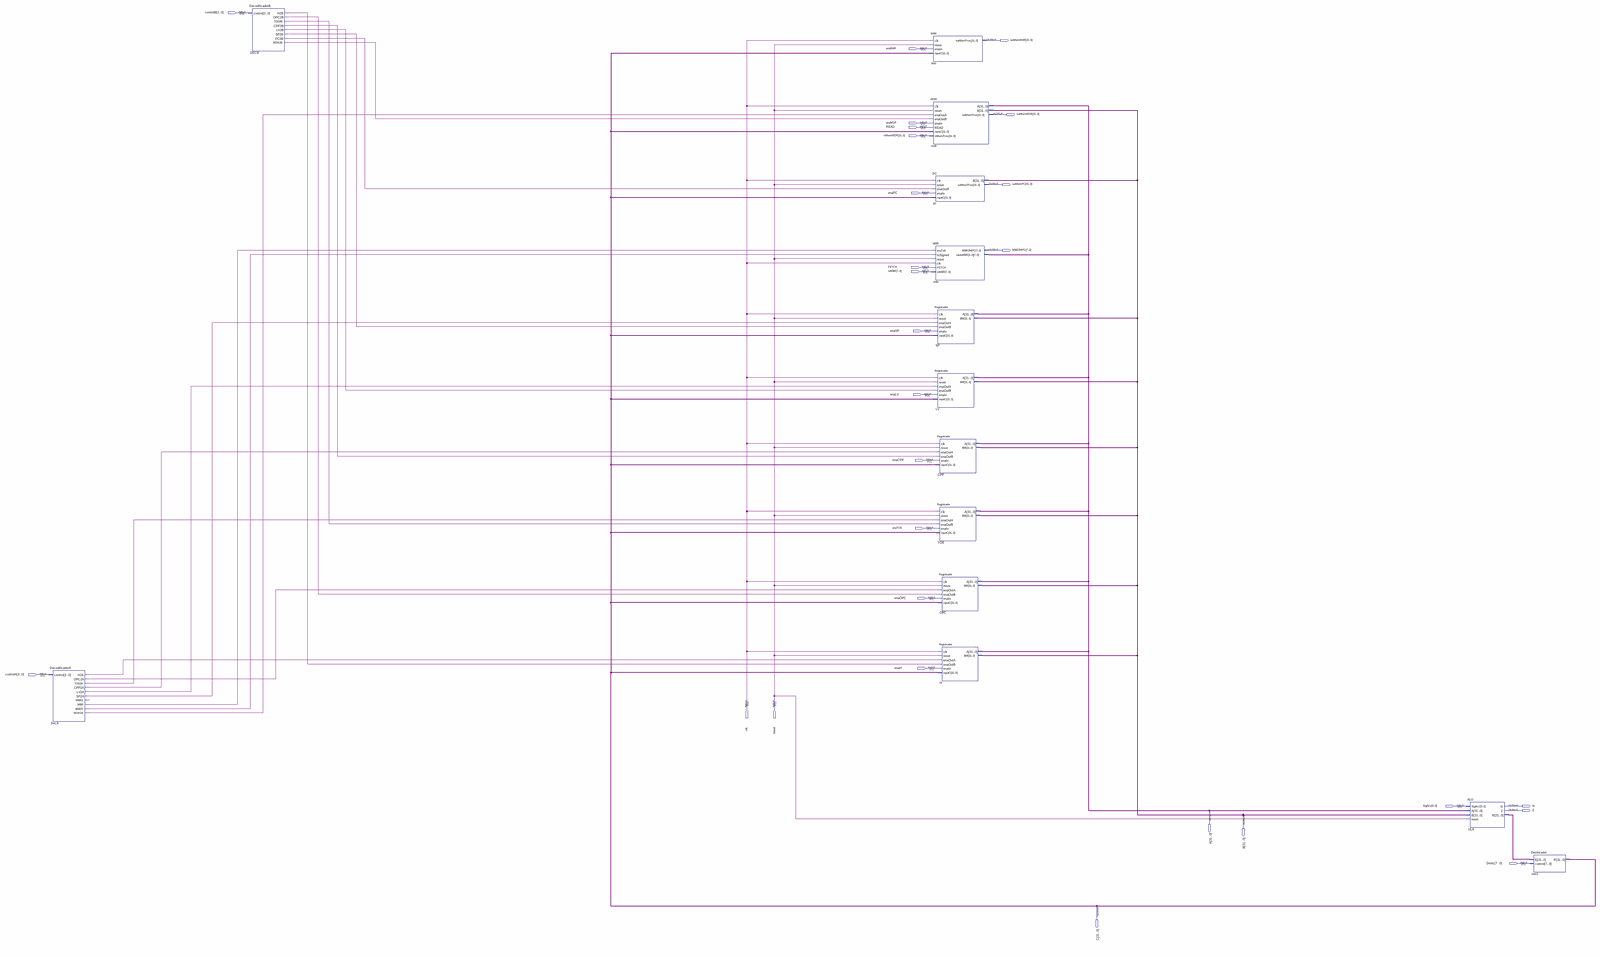
[diagram p0: schematic sheet, whole]
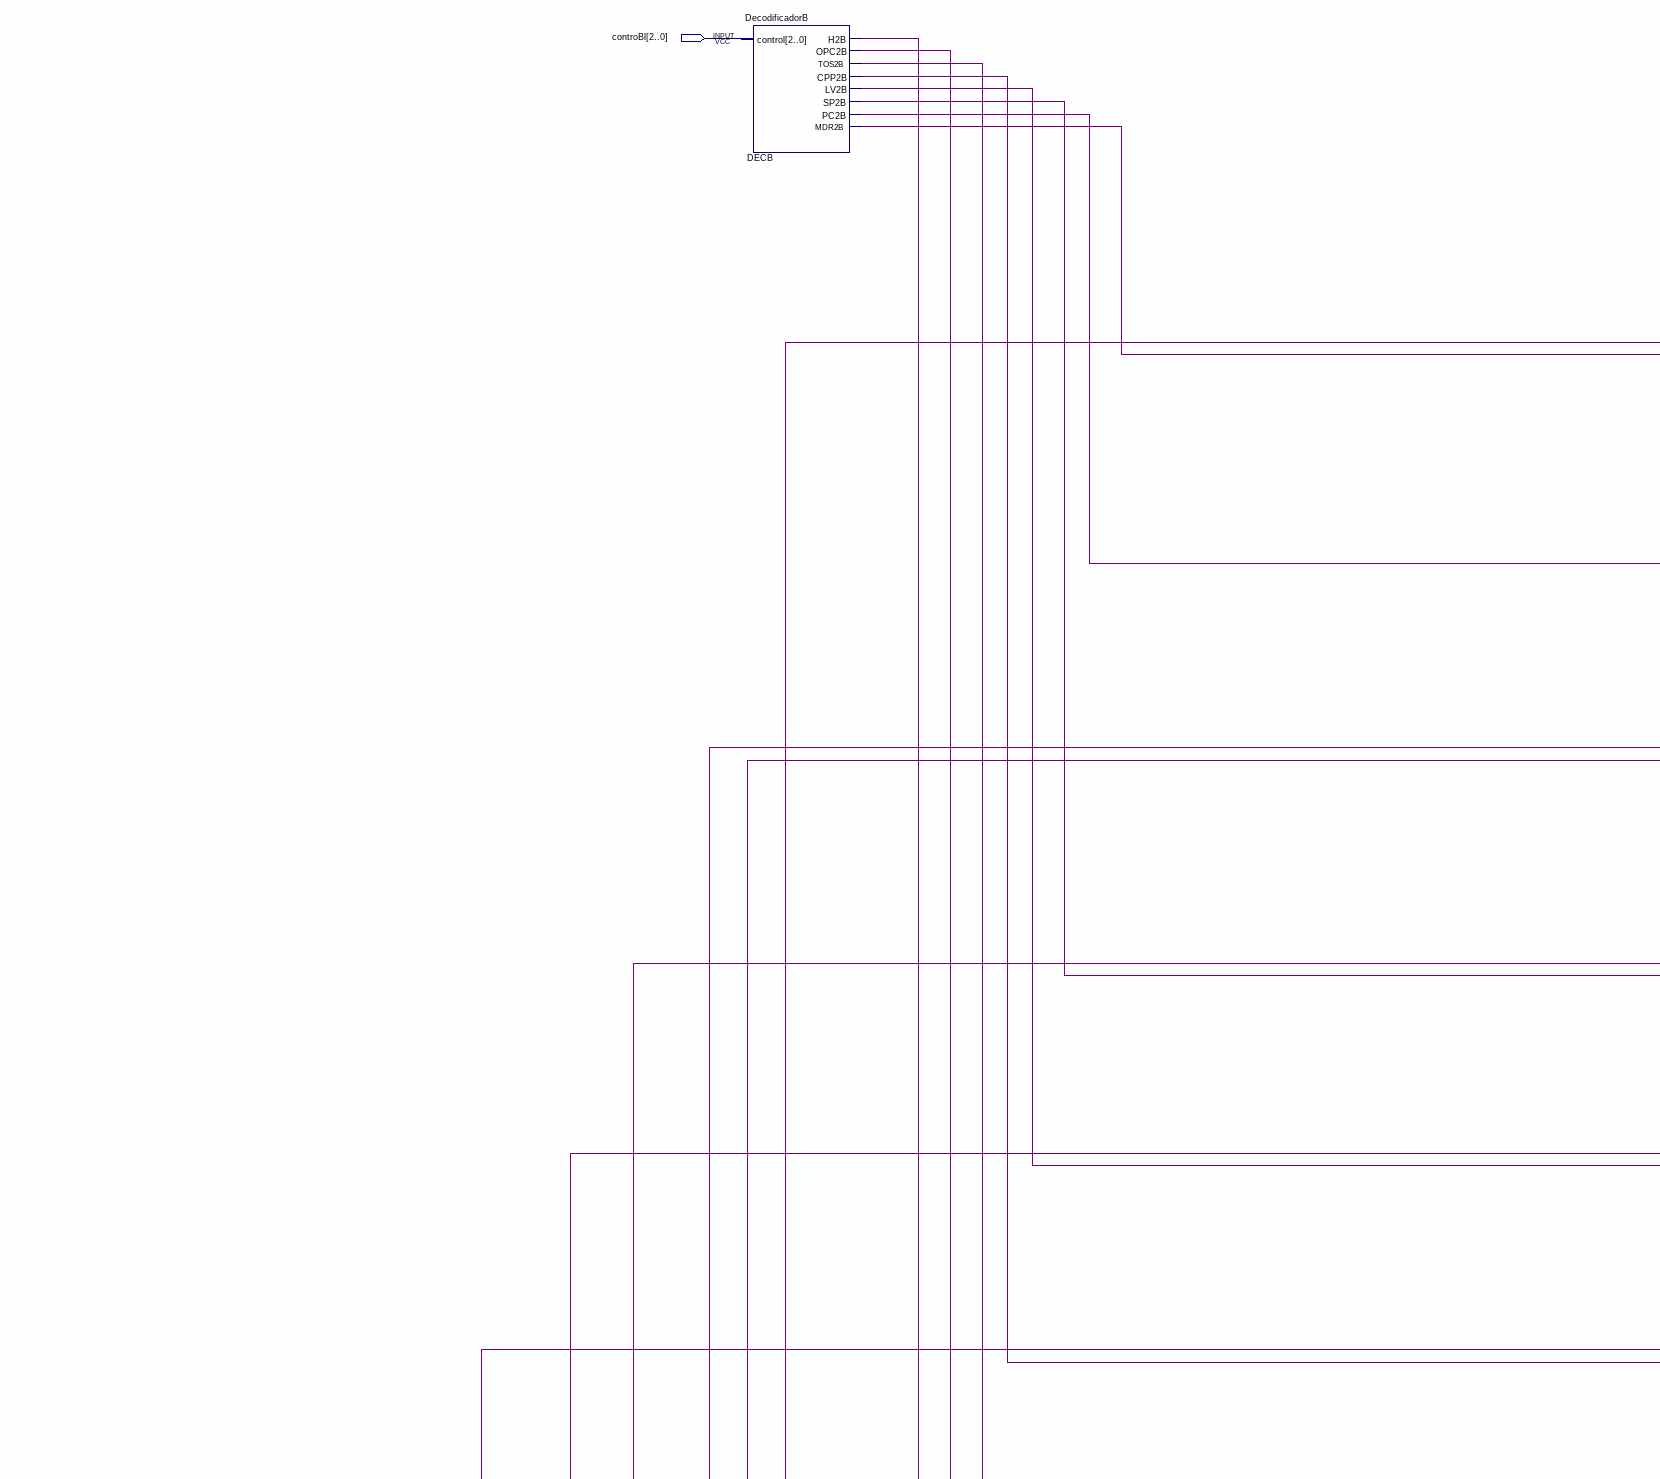
[diagram p1: schematic sheet, upper left part]
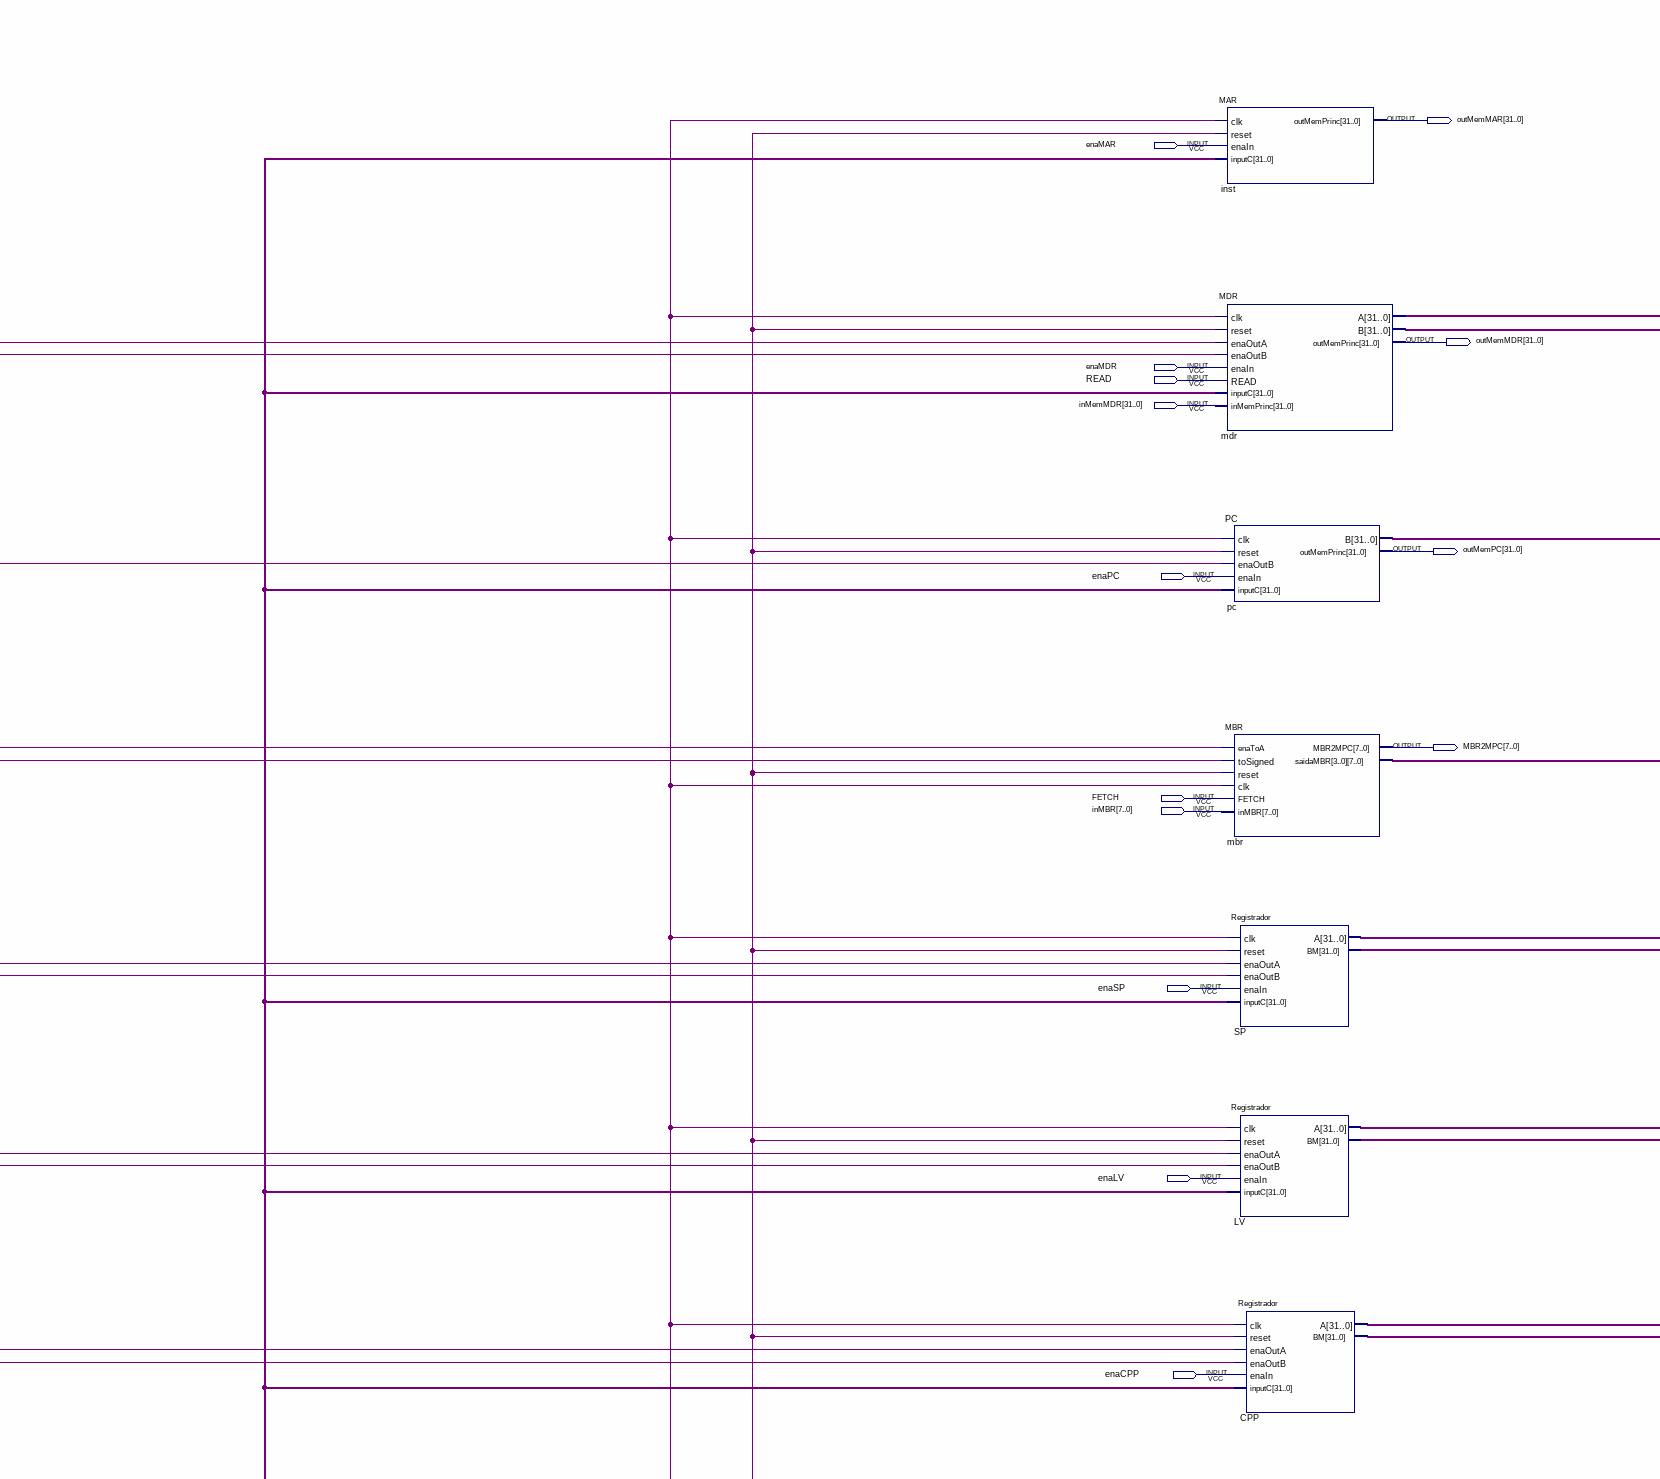
[diagram p2: schematic sheet, upper centre part]
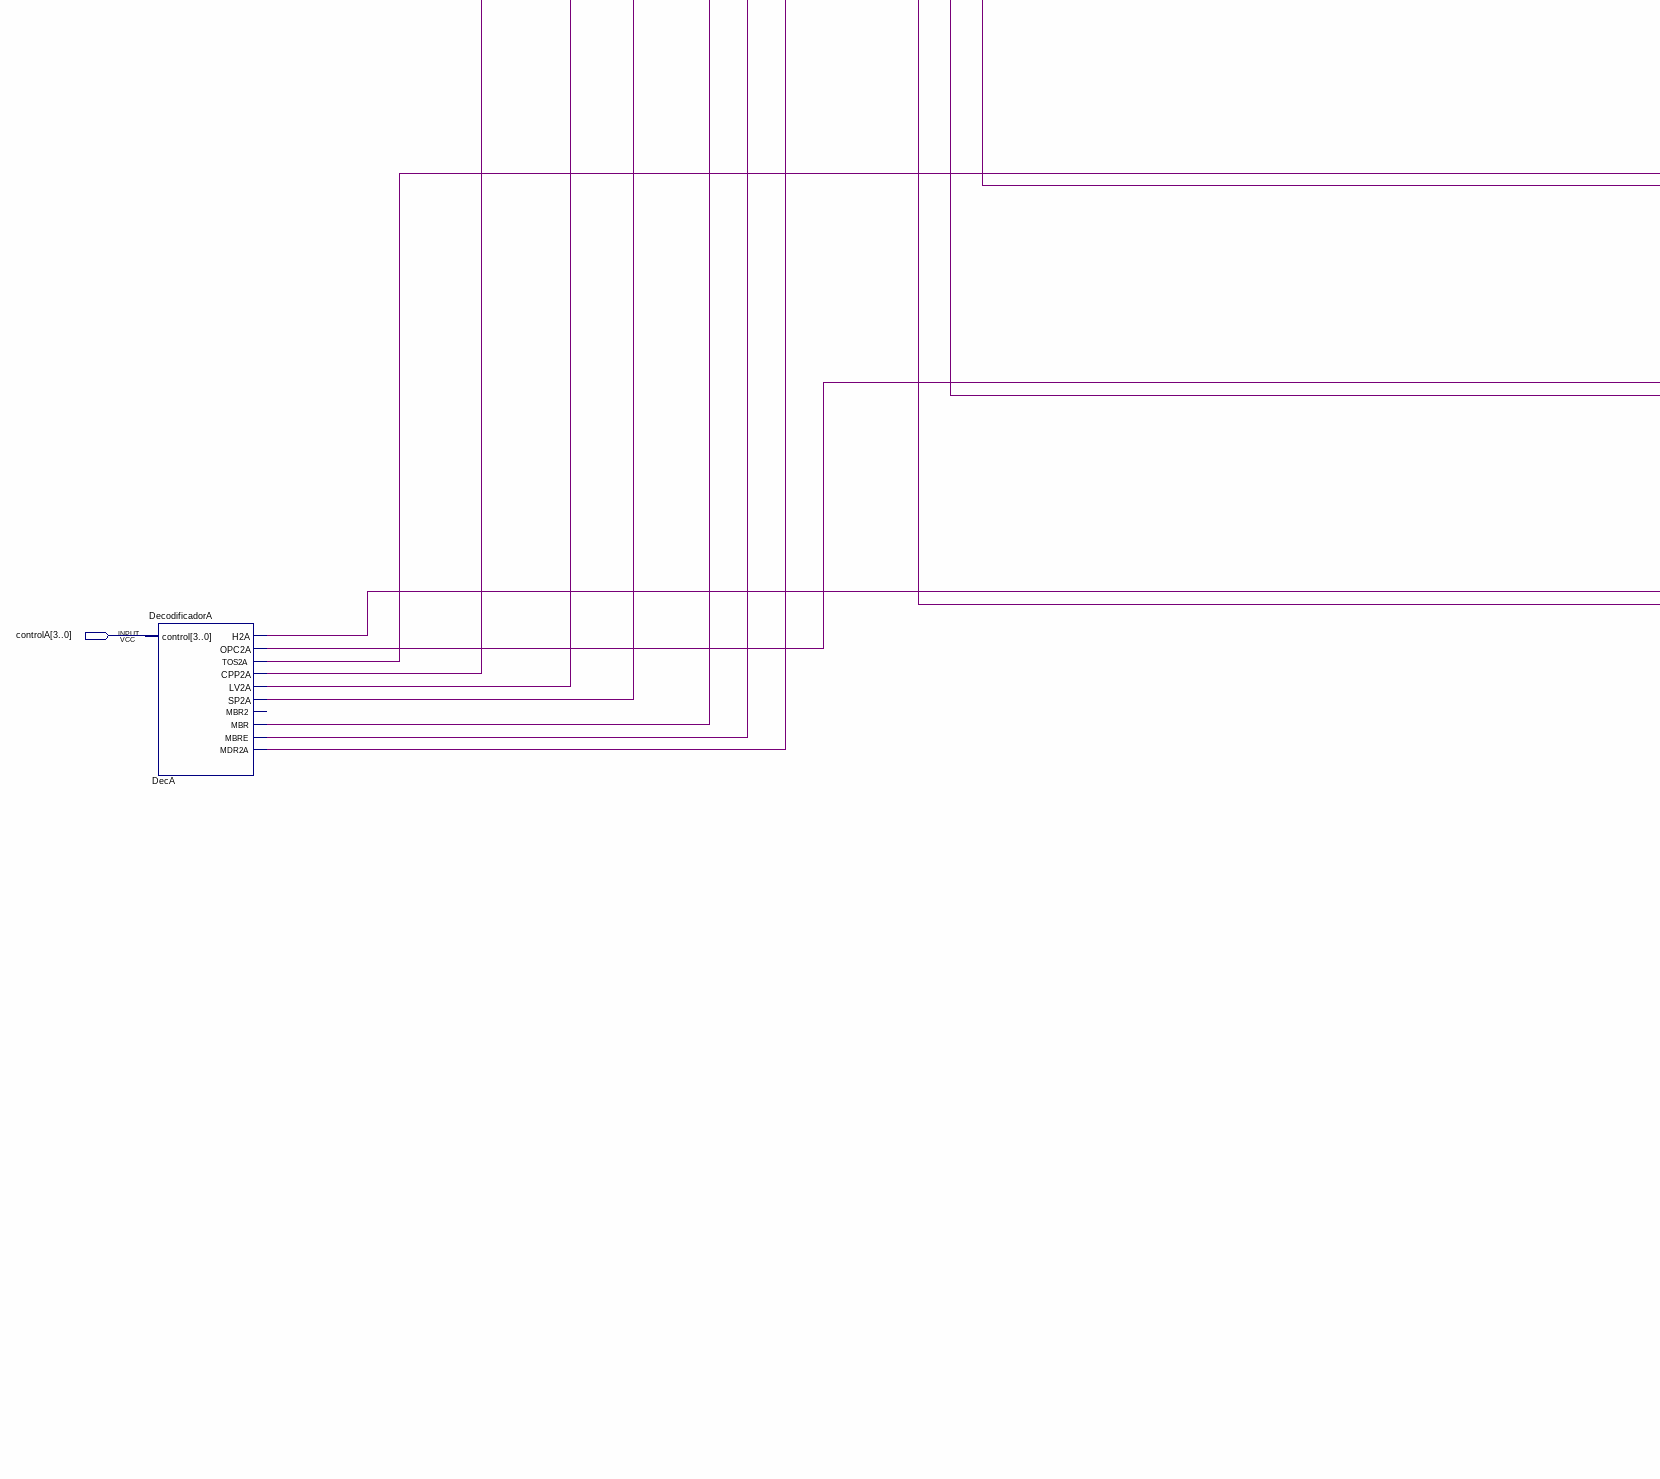
[diagram p3: schematic sheet, lower left part]
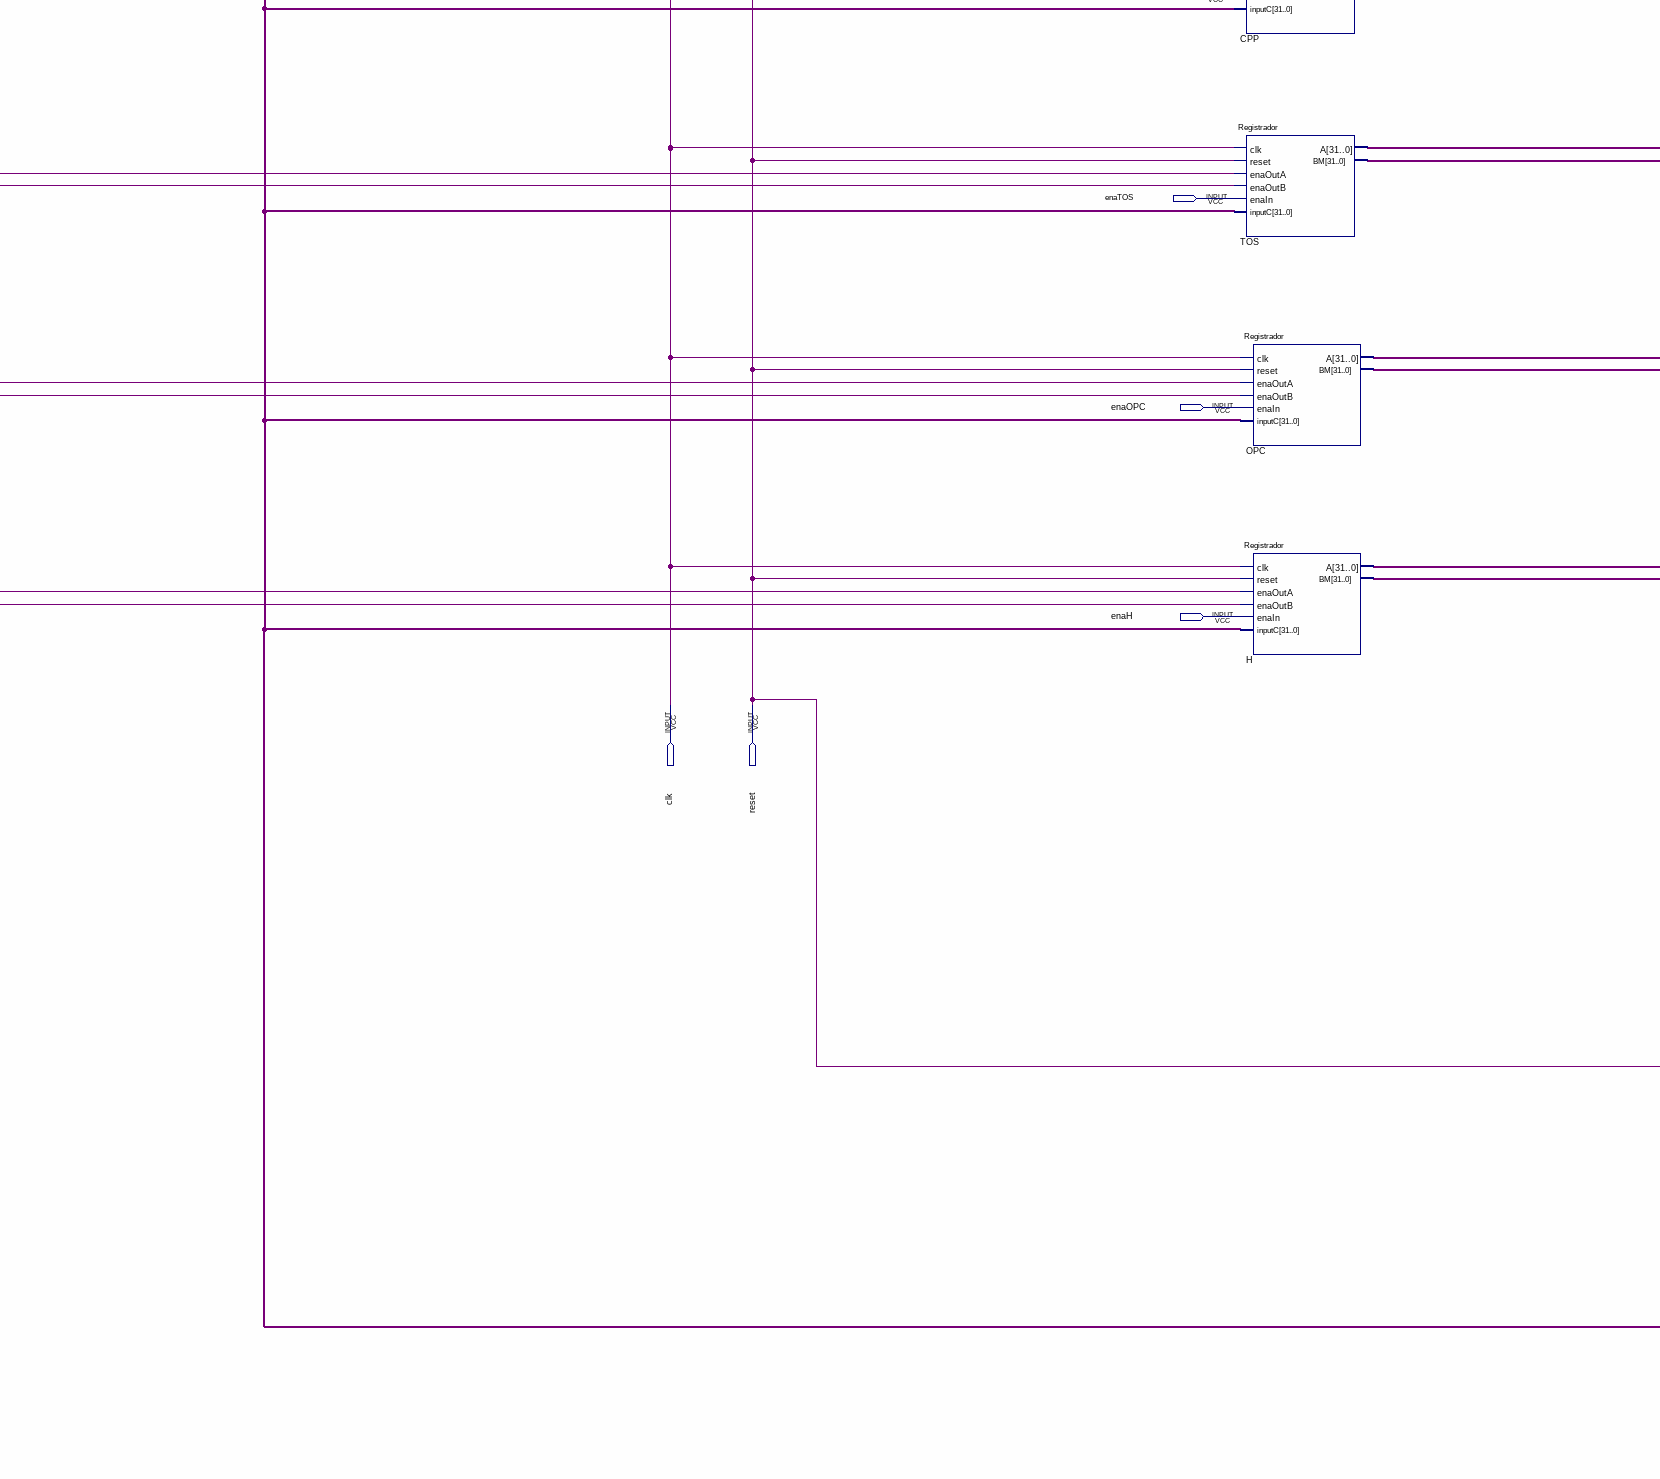
[diagram p4: schematic sheet, lower centre part]
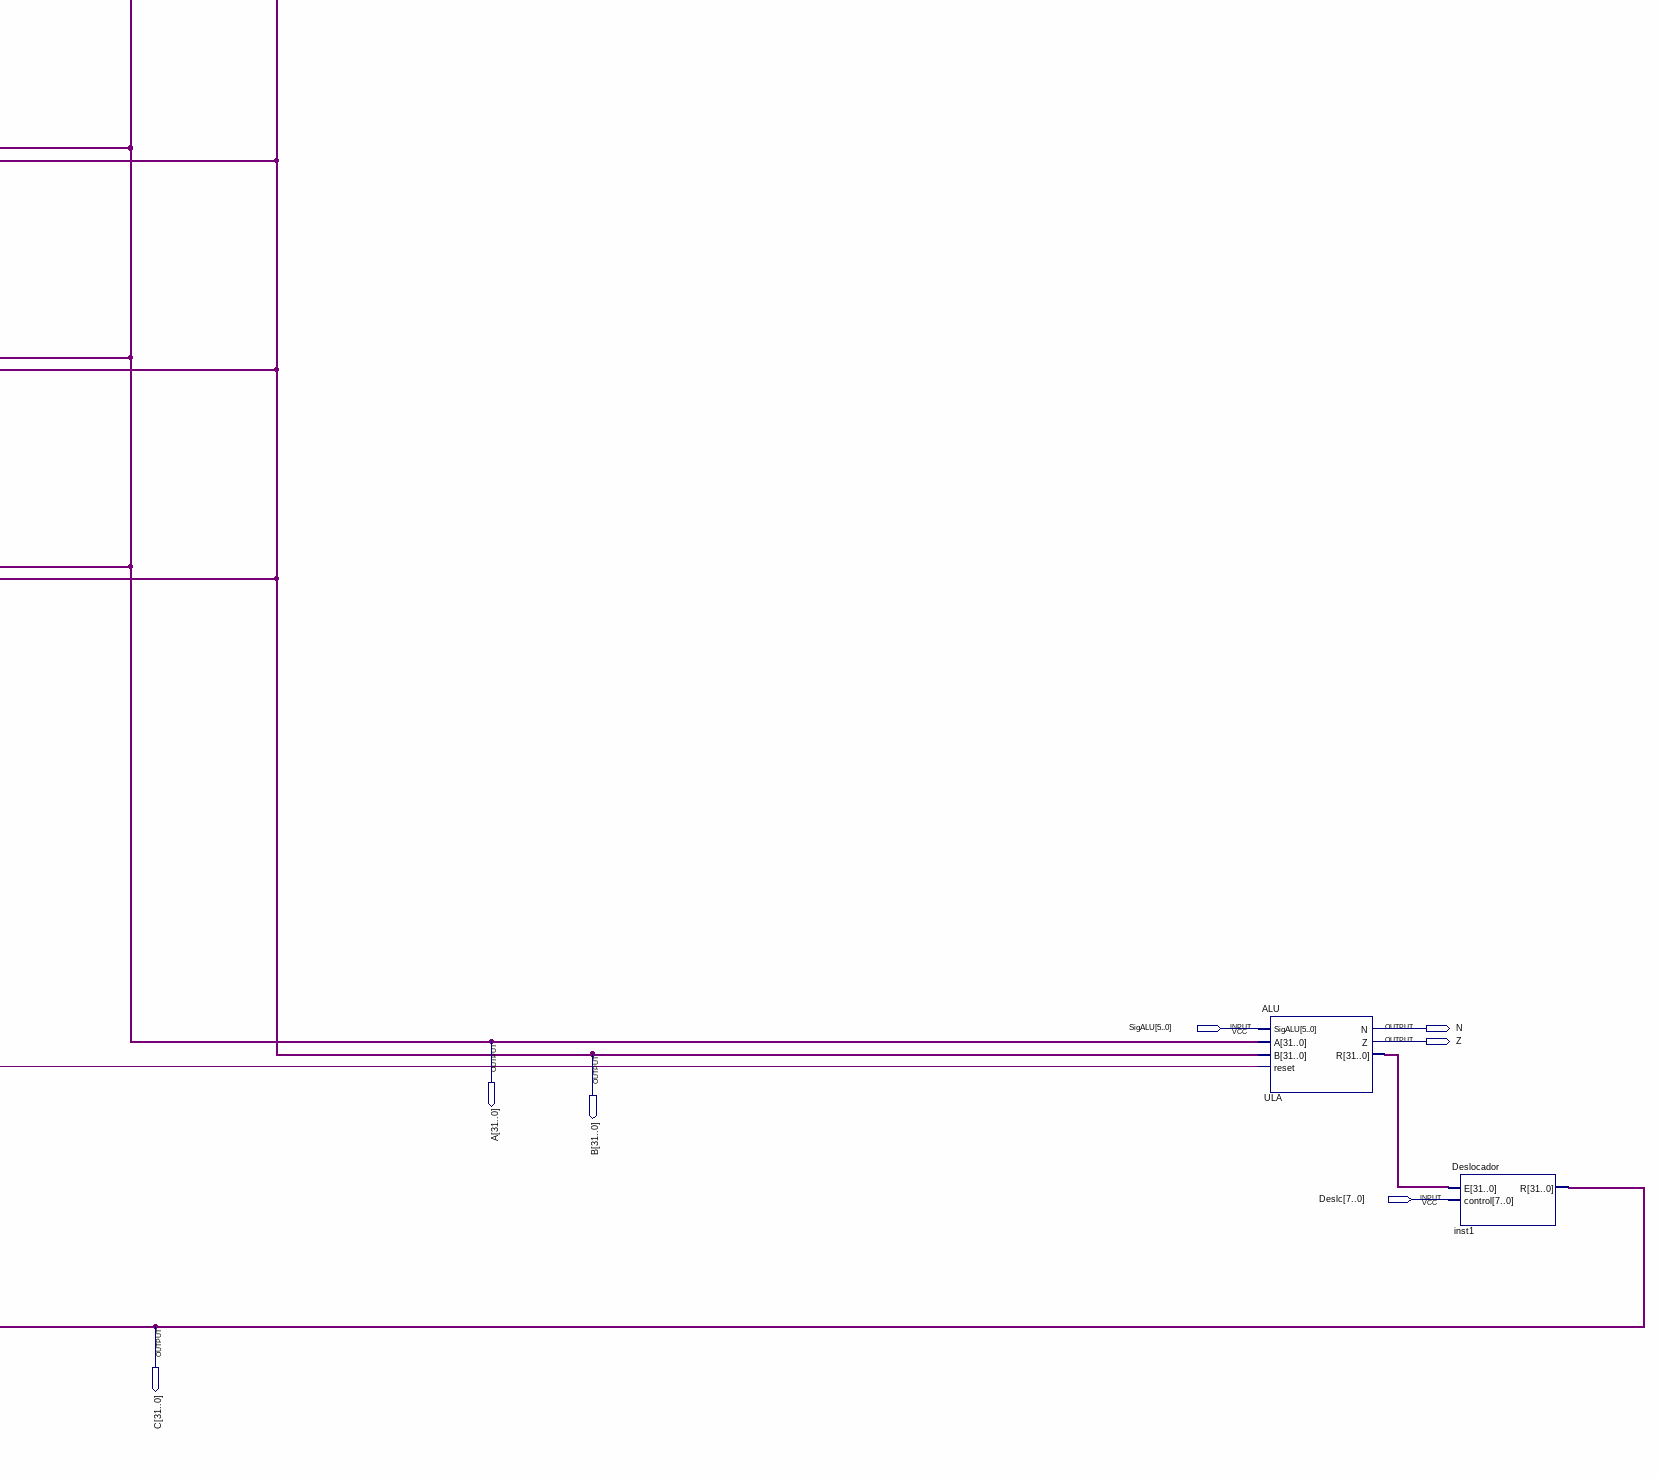
[diagram p5: schematic sheet, lower right part]
// Quartus schematic DATA_PATH.bdf as structural Verilog: 14 symbols, 28 pins
module DATA_PATH (
  input  [2:0] controBl,
  input  enaMAR,
  input  enaMDR,
  input  READ,
  input  [31:0] inMemMDR,
  input  enaPC,
  input  FETCH,
  input  [7:0] inMBR,
  input  enaSP,
  input  enaLV,
  input  enaCPP,
  input  enaTOS,
  input  enaOPC,
  input  enaH,
  input  [3:0] controlA,
  input  clk,
  input  reset,
  input  [5:0] SigALU,
  input  [7:0] Deslc,
  output [31:0] outMemMAR,
  output [31:0] outMemMDR,
  output [31:0] outMemPC,
  output [7:0] MBR2MPC,
  output N,
  output [31:0] A,
  output Z,
  output [31:0] B,
  output [31:0] C
);

  wire DecA_cpp2a, DecA_h2a, DecA_lv2a, DecA_mbr, DecA_mbre, DecA_mdr2a, DecA_opc2a, DecA_sp2a, DecA_tos2a,
       DECB_cpp2b, DECB_h2b, DECB_lv2b, DECB_mdr2b, DECB_opc2b, DECB_pc2b, DECB_sp2b, DECB_tos2b;
  wire [31:0] ULA_r;

  DecodificadorA DecA (
    .control(controlA), .H2A(DecA_h2a), .OPC2A(DecA_opc2a), .TOS2A(DecA_tos2a), .CPP2A(DecA_cpp2a),
    .LV2A(DecA_lv2a), .SP2A(DecA_sp2a), .MBR(DecA_mbr), .MBRE(DecA_mbre), .MDR2A(DecA_mdr2a));  // open: MBR2
  DecodificadorB DECB (
    .control(controBl), .H2B(DECB_h2b), .OPC2B(DECB_opc2b), .TOS2B(DECB_tos2b), .CPP2B(DECB_cpp2b),
    .LV2B(DECB_lv2b), .SP2B(DECB_sp2b), .PC2B(DECB_pc2b), .MDR2B(DECB_mdr2b));
  MAR inst (.clk(clk), .reset(reset), .enaIn(enaMAR), .inputC(C), .outMemPrinc(outMemMAR));
  MDR mdr (
    .clk(clk), .reset(reset), .enaOutA(DecA_mdr2a), .enaOutB(DECB_mdr2b), .enaIn(enaMDR), .READ(READ),
    .inputC(C), .inMemPrinc(inMemMDR), .A(A), .B(B), .outMemPrinc(outMemMDR));
  PC pc (.clk(clk), .reset(reset), .enaOutB(DECB_pc2b), .enaIn(enaPC), .inputC(C), .B(B), .outMemPrinc(outMemPC));
  MBR mbr (
    .enaToA(DecA_mbr), .toSigned(DecA_mbre), .reset(reset), .clk(clk), .FETCH(FETCH), .inMBR(inMBR),
    .MBR2MPC(MBR2MPC), .saidaMBR(A));
  Registrador SP (
    .clk(clk), .reset(reset), .enaOutA(DecA_sp2a), .enaOutB(DECB_sp2b), .enaIn(enaSP), .inputC(C), .A(A),
    .BM(B));
  Registrador LV (
    .clk(clk), .reset(reset), .enaOutA(DecA_lv2a), .enaOutB(DECB_lv2b), .enaIn(enaLV), .inputC(C), .A(A),
    .BM(B));
  Registrador CPP (
    .clk(clk), .reset(reset), .enaOutA(DecA_cpp2a), .enaOutB(DECB_cpp2b), .enaIn(enaCPP), .inputC(C), .A(A),
    .BM(B));
  Registrador TOS (
    .clk(clk), .reset(reset), .enaOutA(DecA_tos2a), .enaOutB(DECB_tos2b), .enaIn(enaTOS), .inputC(C), .A(A),
    .BM(B));
  Registrador OPC (
    .clk(clk), .reset(reset), .enaOutA(DecA_opc2a), .enaOutB(DECB_opc2b), .enaIn(enaOPC), .inputC(C), .A(A),
    .BM(B));
  Registrador H (
    .clk(clk), .reset(reset), .enaOutA(DecA_h2a), .enaOutB(DECB_h2b), .enaIn(enaH), .inputC(C), .A(A), .BM(B));
  ALU ULA (.SigALU(SigALU), .A(A), .B(B), .reset(reset), .N(N), .Z(Z), .R(ULA_r));
  Deslocador inst1 (.E(ULA_r), .control(Deslc), .R(C));
endmodule
